# EAGLE design BlueToothStepperV2 (EAGLE 6.5.0)
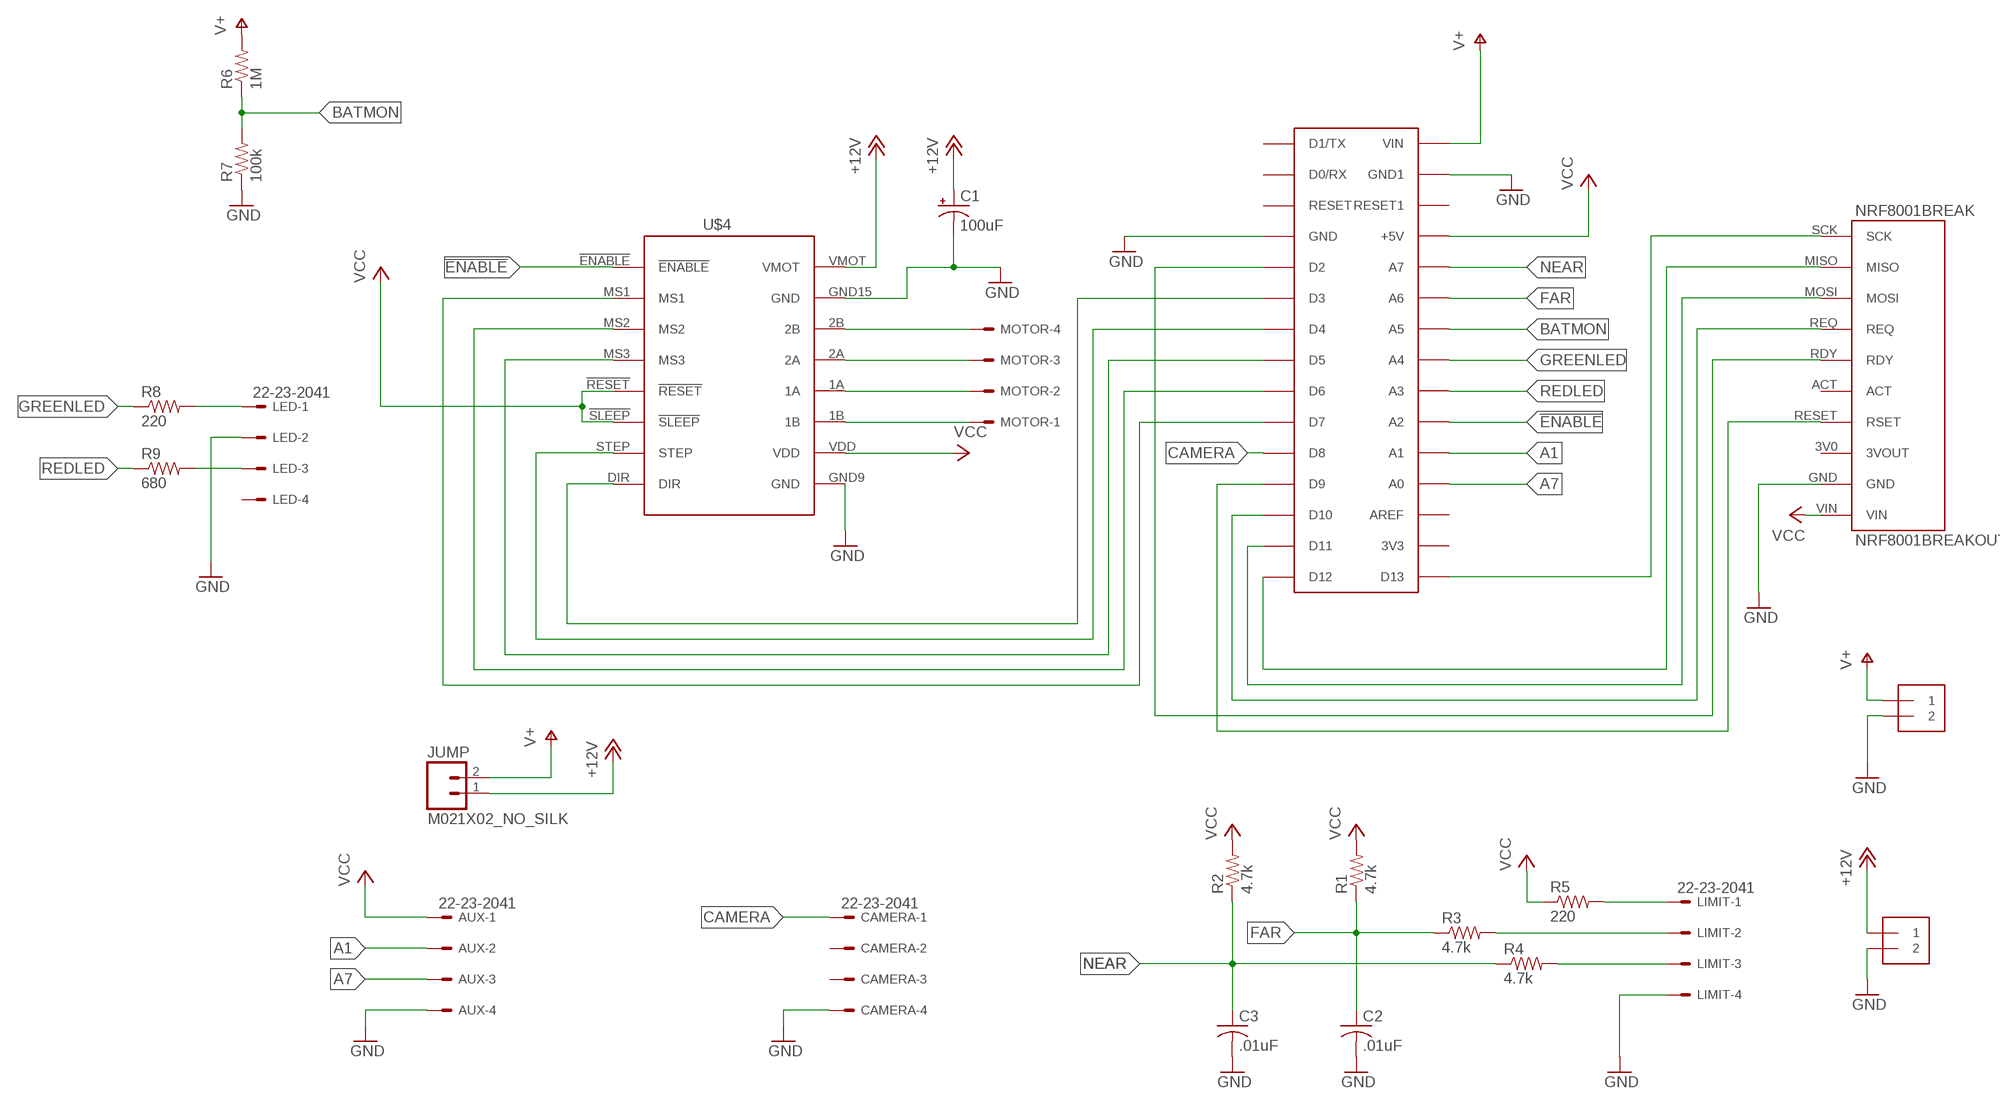
[diagram p0: schematic, sheet 1]

## Parts
7VOLT  1X2-3.5MM  [1X2-3.5MM]
12VOLT  1X2-3.5MM  [1X2-3.5MM]
AUX  22-23-2041  [22-23-2041]
C1  100uF  CPOL-USE3.5-8  [E3,5-8]
C2  .01uF  C-US050-030X075  [C050-030X075]
C3  .01uF  C-US050-030X075  [C050-030X075]
CAMERA  22-23-2041  [22-23-2041]
JUMP  M021X02_NO_SILK  [1X02_NO_SILK]
LED  22-23-2041  [22-23-2041]
LIMIT  22-23-2041  [22-23-2041]
MOTOR  22-23-2041  [22-23-2041]
NANO  ARDUINONANO  [PDIP-32]
NRF8001BREAK  NRF8001BREAKOUT  [BREAKOUTV2]
R1  4.7k  R-US_0207/9  [0207/9]
R2  4.7k  R-US_0207/9  [0207/9]
R3  4.7k  R-US_0207/9  [0207/9]
R4  4.7k  R-US_0207/9  [0207/9]
R5  220  R-US_0207/9  [0207/9]
R6  1M  R-US_0207/9  [0207/9]
R7  100k  R-US_0207/9  [0207/9]
R8  220  R-US_0207/9  [0207/9]
R9  680  R-US_0207/9  [0207/9]
U$4  STEPPER1616PINV2  [STEPPER16PINV2]

## Nets
!ENABLE: NANO.A2 U$4.!ENABLE
+12V [power]: 12VOLT.1 C1.+ JUMP.1 U$4.VMOT
A1: AUX.2 NANO.A1
A7: AUX.3 NANO.A0
BATMON: NANO.A5 R6.1 R7.2
CAMERA: CAMERA.1 NANO.D8
FAR: C2.1 NANO.A6 R1.1 R3.1
GND: 7VOLT.2 12VOLT.2 AUX.4 C1.- C2.2 C3.2 CAMERA.4 LED.2 LIMIT.4 NANO.GND NANO.GND1 NRF8001BREAK.GND R7.1 U$4.GND9(GND) U$4.GND15(GND)
GREENLED: NANO.A4 R8.1
N$1: NANO.D13 NRF8001BREAK.SCK
N$2: NANO.D12 NRF8001BREAK.MISO
N$3: NANO.D11 NRF8001BREAK.MOSI
N$4: NANO.D10 NRF8001BREAK.REQ
N$5: NANO.D2 NRF8001BREAK.RDY
N$6: NANO.D9 NRF8001BREAK.RESET(RSET)
N$7: LIMIT.1 R5.2
N$9: NANO.D4 U$4.STEP
N$10: NANO.D3 U$4.DIR
N$11 [power]: MOTOR.4 U$4.2B
N$12: LIMIT.2 R3.2
N$13 [power]: MOTOR.3 U$4.2A
N$14 [power]: MOTOR.2 U$4.1A
N$15 [power]: MOTOR.1 U$4.1B
N$17: LIMIT.3 R4.2
N$18: NANO.D5 U$4.MS3
N$19: NANO.D6 U$4.MS2
N$20: NANO.D7 U$4.MS1
N$21: LED.1 R8.2
N$22: LED.3 R9.2
NEAR: C3.1 NANO.A7 R2.1 R4.1
REDLED: NANO.A3 R9.1
V+: 7VOLT.1 JUMP.2 NANO.VIN R6.2
VCC: AUX.1 NANO.+5V NRF8001BREAK.VIN R1.2 R2.2 R5.1 U$4.!RESET U$4.!SLEEP U$4.VDD
Unconnected: CAMERA.2 CAMERA.3 LED.4 NANO.3V3 NANO.AREF NANO.D0/RX NANO.D1/TX NANO.RESET NANO.RESET1 NRF8001BREAK.3V0(3VOUT) NRF8001BREAK.ACT

## Library data of the parts
7VOLT 12VOLT = adafruit:1X2: 3.5mm Terminal block http://www.ladyada.net/library/pcb/eaglelibrary.html
AUX CAMERA LED LIMIT MOTOR = con-molex:22-23-2041: .100" (2.54mm) Center Header - 4 Pin; MF: MOLEX; MPN: 22-23-2041; OC_FARNELL: 1462920; OC_NEWARK: 38C0355
C1 = adafruit:CPOL-US: POLARIZED CAPACITOR, American symbol
C2 C3 = adafruit:C-US: CAPACITOR, American symbol
JUMP = SparkFun-Connectors:M02: Standard 2-pin 0.1" header. Use with - straight break away headers ( PRT-00116) - right angle break away headers (PRT-00553) - swiss pins (PRT-00743) - machine pins (PRT-00117) - female headers (PRT-00115) Molex polarized connector foot print use with: PRT-08233 with associated crimp pins and housings. 2.54_SCREWTERM for use with PRT-10571. 3.5mm Screw Terminal footprints for PRT-08084 5mm Screw Terminal footprints for use with PRT-08433
NANO = jet-lib:ARDUINONANO: Arduino Nano V3
NRF8001BREAK = adafruitBluetoothLEnRF8001:NRF8001BREAKOUT: The blue tooth breakeout board from adafruit
R1-R9 = adafruit:R-US_: RESISTOR, American symbol
U$4 = stepper16V2:STEPPER16: stepper

## Net classes
0 default: width 0.012 mm
1 power: width 0.056 mm
2 powerSmaller: width 0.02 mm

## Board
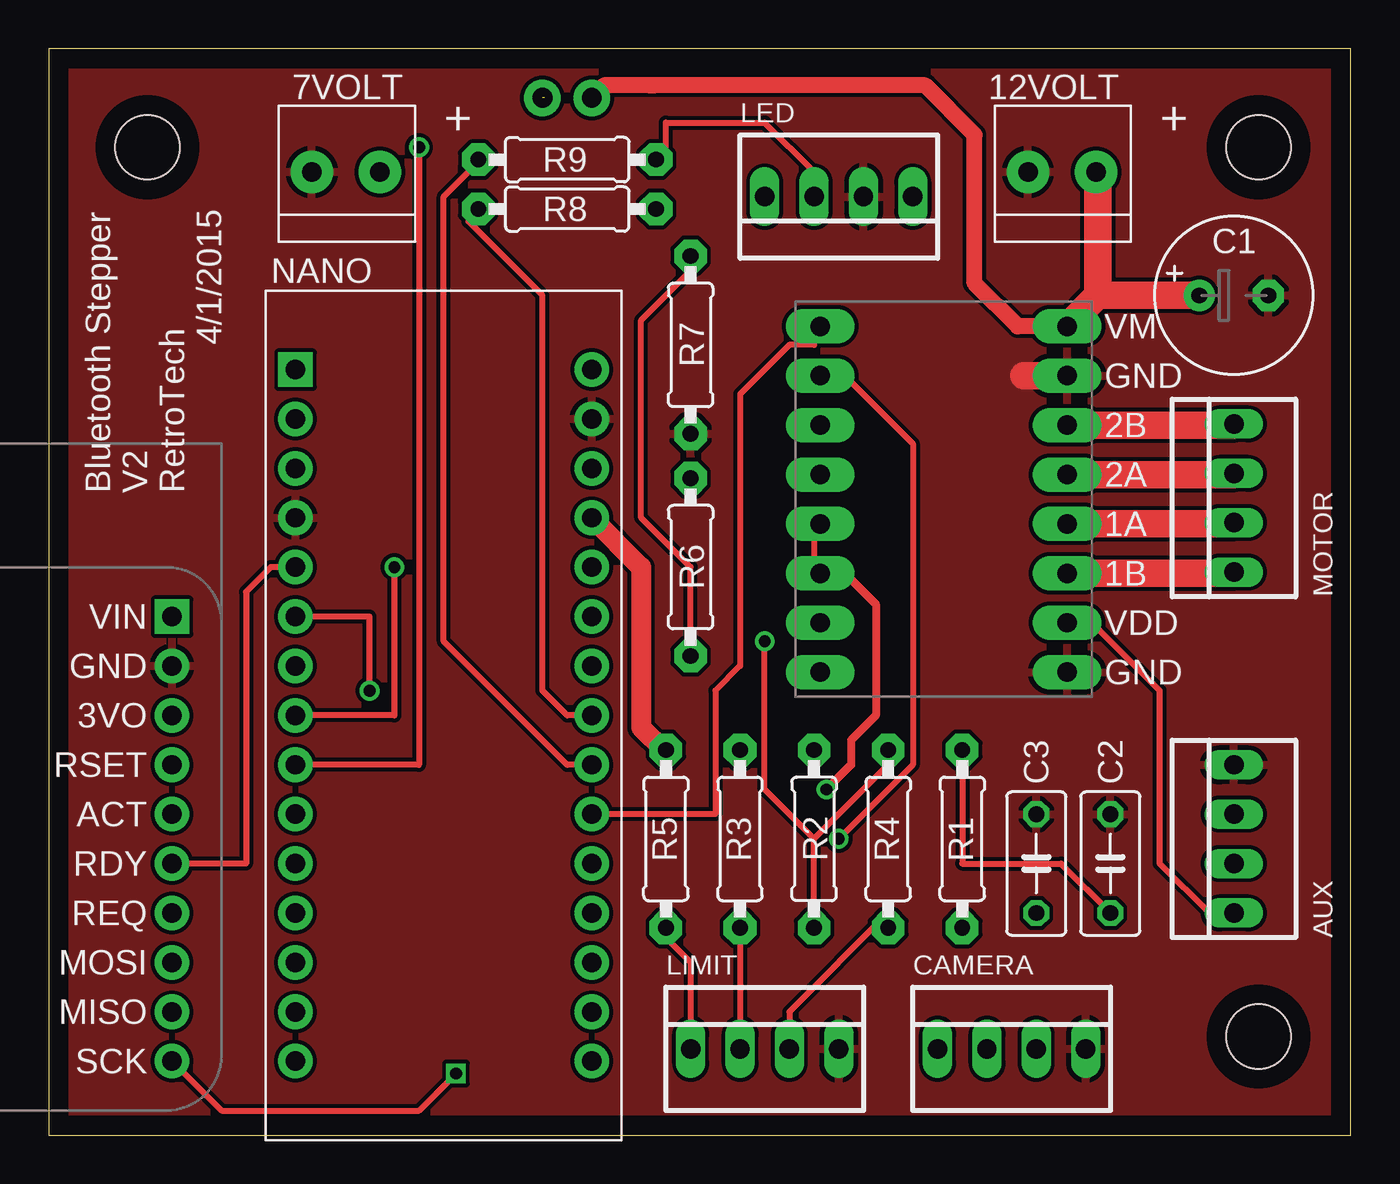
[diagram p1: board, top side]
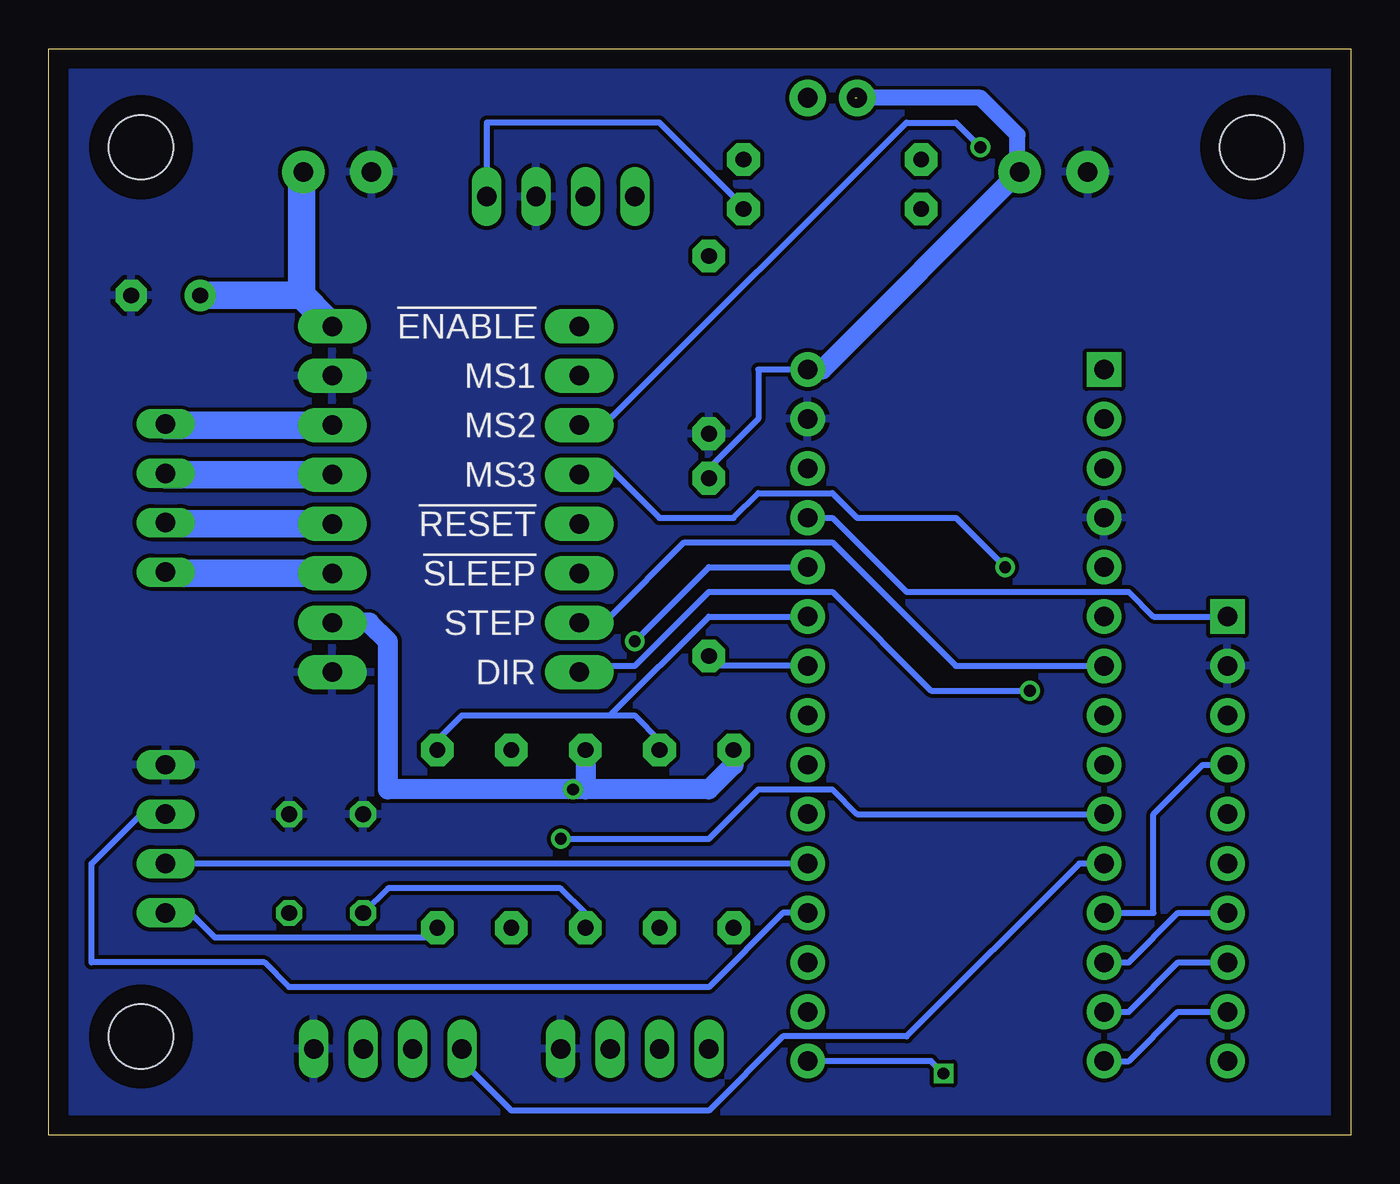
[diagram p2: board, bottom side, seen from below]

Size 66.98 x 55.87 mm. Coordinates in mm from the lower left corner, seen from the top.
Outline: 0,0 66.98,0 66.98,55.87 0,55.87 0,0
Copper layers (1*16): Top 0.035mm / dielectric 1.5mm / Bottom 0.035mm
Design rules "default *": minimum track width 12mil, minimum drill 24mil, track to track 8mil, track to pad 8mil, pad to pad 8mil, via to via 8mil, smd to smd 8mil, copper to edge 40mil, drill to drill 8mil, minimum pad ring 10mil, minimum via ring 8mil, stop-mask expansion 4mil, vias tented up to drill 0mil, thermal gap 10mil

### Footprints (pad centres in the part's own frame; a part is rotated, then mirrored left to right if it is on the bottom)
1X2-3.5MM = drill 1 pad 2.184: 1 1.8,0; 2 -1.7,0
22-23-2041 = drill 1 long: 1 -3.81,0; 2 -1.27,0; 3 1.27,0; 4 3.81,0
E3,5-8 = drill 0.813 pad 1.6: + -1.778,0 | drill 0.813 pad 1.6 octagon: - 1.778,0
C050-030X075 = drill 0.813 octagon: 1 -2.54,0; 2 2.54,0
1X02_NO_SILK = drill 1.016 pad 1.88: 1 0,0; 2 2.54,0
PDIP-32 = drill 1 pad 1.778: 3V3 15.24,-35.56; +5V 15.24,-10.16; A0 15.24,-30.48; A1 15.24,-27.94; A2 15.24,-25.4; A3 15.24,-22.86; A4 15.24,-20.32; A5 15.24,-17.78; A6 15.24,-15.24; A7 15.24,-12.7; AREF 15.24,-33.02; D0/RX 0,-5.08; D2 0,-12.7; D3 0,-15.24; D4 0,-17.78; D5 0,-20.32; D6 0,-22.86; D7 0,-25.4; D8 0,-27.94; D9 0,-30.48; D10 0,-33.02; D11 0,-35.56; D12 0,-38.1; D13 15.24,-38.1; GND 0,-10.16; GND1 15.24,-5.08; RESET 0,-7.62; RESET1 15.24,-7.62; VIN 15.24,-2.54 | drill 1 pad 1.778 square: D1/TX 0,-2.54
BREAKOUTV2 = drill 1 pad 1.778: 3V0 3.81,-8.89; ACT 3.81,-3.81; GND 3.81,-11.43; MISO 3.81,6.35; MOSI 3.81,3.81; RDY 3.81,-1.27; REQ 3.81,1.27; RESET 3.81,-6.35; SCK 3.81,8.89 | drill 1 pad 1.778 square: VIN 3.81,-13.97
0207/9 = drill 0.813 pad 1.676 octagon: 1 -4.572,0; 2 4.572,0
STAND-OFF = hole 3.302: 0,0
STEPPER16PINV2 = drill 1 pad 1.778 long: 1A 6.35,-1.27; 1B 6.35,-3.81; 2A 6.35,1.27; 2B 6.35,3.81; !ENABLE -6.35,8.89; !RESET -6.35,-1.27; !SLEEP -6.35,-3.81; DIR -6.35,-8.89; GND9 6.35,-8.89; GND15 6.35,6.35; MS1 -6.35,6.35; MS2 -6.35,3.81; MS3 -6.35,1.27; STEP -6.35,-6.35; VDD 6.35,-6.35; VMOT 6.35,8.89

### Placement (x,y rotation side)
7VOLT  15.24,49.53 0 top
12VOLT  52.07,49.53 0 top
AUX  60.96,15.24 90 top
C1  60.96,43.18 0 top
C2  54.61,13.97 90 top
C3  50.8,13.97 90 top
CAMERA  49.53,4.45 0 top
JUMP  27.94,53.34 180 top
LED  40.64,48.26 180 top
LIMIT  36.83,4.45 0 top
MOTOR  60.96,32.77 90 top
NANO  12.7,41.91 0 top
NRF8001BREAK  10.16,12.7 180 top
R1  46.99,15.24 270 top
R2  39.37,15.24 90 top
R3  35.56,15.24 270 top
R4  43.18,15.24 270 top
R5  31.75,15.24 270 top
R6  33.02,29.21 90 top
R7  33.02,40.64 90 top
R8  26.67,47.62 0 top
R9  26.67,50.16 0 top
U$1  [STAND-OFF]  5.08,50.8 0 top
U$4  46.04,32.7 0 top
U$5  [STAND-OFF]  62.23,5.08 0 top
U$6  [STAND-OFF]  62.23,50.8 0 top

### Tracks (layer width: path | path; a pad name or v marks a point on that pad's centre or on a via)
!ENABLE
  Top 0.305: NANO.A2 34.29,16.51 34.29,22.86 35.56,24.13 35.56,38.1 38.1,40.64 39.37,40.64 39.37,41.91 U$4.!ENABLE
+12V
  Top 0.813: U$4.VMOT 49.85,41.59 47.62,43.81 47.62,51.44 45.09,53.98 31.11,53.98 30.91,53.98 28.57,53.98 JUMP.1
  Top 1.422: 12VOLT.1 53.98,49.42 53.98,43.18 | 53.98,43.18 U$4.VMOT | C1.+ 53.98,43.18
A1
  Bottom 0.305: NANO.A1 AUX.2
A7
  Bottom 0.305: AUX.3 62.23,16.51 64.77,13.97 64.77,8.89 55.88,8.89 54.61,7.62 33.02,7.62 29.21,11.43 NANO.A0
BATMON
  Top 0.305: R6.1 33.02,29.21 30.48,31.75 30.48,41.91 33.02,44.45 R7.2
  Bottom 0.305: NANO.A5 33.02,24.13 R6.1
CAMERA
  Bottom 0.305: NANO.D8 13.97,13.97 22.86,5.08 29.21,5.08 33.02,1.27 43.18,1.27 45.72,3.81 CAMERA.1
FAR
  Top 0.305: C2.1 52.07,13.97 46.99,13.97 R1.1
  Bottom 0.305: 38.1,21.59 45.72,21.59 46.99,20.32 R1.1 | 38.1,21.59 36.83,21.59 35.56,20.32 R3.1 | NANO.A6 33.02,26.67 38.1,21.59
GND
  Top 1.422: U$4.GND15 50.16,39.05
  pour Top: -1.27,57.15 68.58,57.15 68.58,-1.27 -1.27,-1.27
  pour Bottom: -1.27,56.52 -1.27,-1.27 67.94,-1.27 67.94,56.52
GREENLED
  Top 0.305: NANO.A4 26.67,21.59 25.4,22.86 25.4,43.18 21.59,46.99 R8.1
N$1  (via drill 0.6)
  Top 0.305: NRF8001BREAK.SCK 8.89,1.27 19.05,1.27 v20.95,3.17
  Bottom 0.305: v20.95,3.17 21.59,3.81 NANO.D13
N$2
  Bottom 0.305: NRF8001BREAK.MISO 8.89,6.35 11.43,3.81 NANO.D12
N$3
  Bottom 0.305: NRF8001BREAK.MOSI 8.89,8.89 11.43,6.35 NANO.D11
N$4
  Bottom 0.305: NRF8001BREAK.REQ 8.89,11.43 11.43,8.89 NANO.D10
N$5
  Top 0.305: NRF8001BREAK.RDY 10.16,13.97 10.16,27.94 11.43,29.21 NANO.D2
N$6
  Bottom 0.305: NRF8001BREAK.RESET 7.62,19.05 10.16,16.51 10.16,11.43 NANO.D9
N$7
  Top 0.305: LIMIT.1 33.02,8.89 31.75,10.16 R5.2
N$9
  Bottom 0.305: NANO.D4 20.32,24.13 26.67,30.48 34.29,30.48 38.1,26.67 39.37,26.67 U$4.STEP
N$10  (via drill 0.61)
  Top 0.305: NANO.D3 16.51,26.67 v16.51,22.86
  Bottom 0.305: v16.51,22.86 21.59,22.86 26.67,27.94 33.02,27.94 36.83,24.13 39.37,24.13 U$4.DIR
N$11
  Top 1.422: MOTOR.4 60.9,36.51 U$4.2B
  Bottom 1.422: 60.96,36.51 U$4.2B
N$12
  Top 0.305: R3.2 LIMIT.2
N$13
  Top 1.422: MOTOR.3 60.9,33.97 U$4.2A
  Bottom 1.422: 60.96,33.97 U$4.2A
N$14
  Top 1.422: MOTOR.2 60.9,31.43 U$4.1A
  Bottom 1.422: 60.96,31.43 U$4.1A
N$15
  Top 1.422: MOTOR.1 60.9,28.89 U$4.1B
  Bottom 1.422: 60.96,28.89 U$4.1B
N$17
  Top 0.305: LIMIT.3 38.1,6.35 43.18,11.43 R4.2
N$18  (via drill 0.61)
  Top 0.305: NANO.D5 17.78,21.59 v17.78,29.21
  Bottom 0.305: v17.78,29.21 20.32,31.75 25.4,31.75 26.67,33.02 30.48,33.02 31.75,31.75 35.56,31.75 38.1,34.29 39.37,34.29 U$4.MS3
N$19  (via drill 0.61)
  Top 0.305: NANO.D6 19.05,19.05 v19.05,50.8
  Bottom 0.305: v19.05,50.8 20.32,52.07 22.86,52.07 38.1,36.83 39.37,36.83 U$4.MS2
N$20  (via drill 0.61)
  Top 0.305: v40.64,15.24 44.45,19.05 44.45,35.56 40.64,39.37 U$4.MS1
  Bottom 0.305: NANO.D7 25.4,16.51 26.67,17.78 30.48,17.78 33.02,15.24 v40.64,15.24
N$21
  Bottom 0.305: LED.1 44.45,52.07 35.56,52.07 31.75,48.26 R8.2
N$22
  Top 0.305: LED.3 39.37,49.53 36.83,52.07 31.75,52.07 31.75,50.8 R9.2
N$24
  Bottom 1.422: 53.98,49.53 53.98,43.18 | 59.05,43.18 53.98,43.18 | 53.98,43.18 52.7,41.91
N$25  (via drill 0.6)
  other vias: 20.95,3.17
NEAR  (via drill 0.61)
  Top 0.305: 39.37,15.24 43.18,19.05 R4.1 | R2.1 39.37,15.24 | v36.83,25.4 36.83,17.78 39.37,15.24
  Bottom 0.305: C3.1 49.53,12.7 40.64,12.7 39.37,11.43 R2.1 | NANO.A7 33.02,29.21 v36.83,25.4
REDLED
  Top 0.305: NANO.A3 26.67,19.05 20.32,25.4 20.32,48.26 21.59,49.53 R9.1
V+  (1 unrouted)
  Bottom 0.305: NANO.VIN 30.48,39.37 30.48,36.83 33.02,34.29 R6.2
  Bottom 0.813: 7VOLT.1 17.14,49.53 17.14,51.44 19.05,53.34 25.5,53.34
  Bottom 1.016: 7VOLT.1 27.2,39.37 NANO.VIN
VCC  (via drill 0.6)
  Top 0.305: AUX.1 59.69,11.43 57.15,13.97 57.15,22.86 53.34,26.67 U$4.VDD | U$4.!SLEEP 39.37,29.21 39.37,31.75 U$4.!RESET
  Top 0.406: 39.37,29.21 40.64,29.21 42.55,27.3 42.55,21.59 41.27,20.32 41.27,19.05 v40.01,17.78
  Top 1.016: NANO.+5V 30.48,29.21 30.48,20.95 31.62,19.81 R5.1
  Bottom 0.305: AUX.1 59.69,11.43 58.42,10.16 46.99,10.16 R1.2 | NANO.+5V 26.67,31.75 22.86,27.94 11.43,27.94 10.16,26.67 NRF8001BREAK.VIN
  Bottom 1.016: 39.37,17.78 33.02,17.78 31.75,19.05 R5.1 | 39.37,17.78 v40.01,17.78 49.53,17.78 49.53,25.4 50.48,26.35 U$4.VDD | R2.2 39.37,17.78

### Text on the board
tPlace: + | + | NANO | 4/1/2015 | Bluetooth Stepper | V2 | RetroTech
bPlace: !ENABLE | MS1 | MS2 | MS3 | !RESET | !SLEEP | STEP | DIR